# Altium schematic sheet power_3V3.SchDoc
size A4
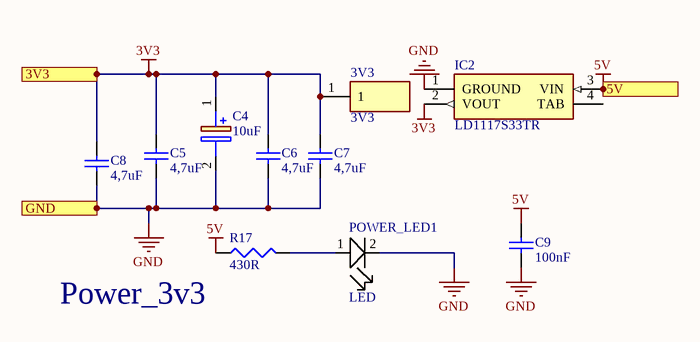
[diagram p0: power_3V3.SchDoc]

## Parts
3V3  3V3  [1508000150000030]
C4  10uF  [CAPPM3216X180N]
C5  4,7uF  [1608[0603]]
C6  4,7uF  [1608[0603]]
C7  4,7uF  [1608[0603]]
C8  4,7uF  [1608[0603]]
C9  100nF  [1608[0603]]
IC2  LD1117S33TR  [SOT230P700X180-4N]
POWER_LED1  LED  [LED5mA]
R17  430R  [J1-0603]

## Ports
3V3 (out), 5V (in), GND (in)

## Nets
3V3: 3V3.1 C4.1(+) C5.1 C6.1 C7.1 C8.1 IC2.2(VOUT) ; port 3V3
5V: C9.1 IC2.3(VIN) R17.1 ; port 5V
GND: C4.2(-) C5.2 C6.2 C7.2 C8.2 C9.2 IC2.1(GROUND) POWER_LED1.2 ; port GND
NetPOWER_LED1_1: POWER_LED1.1 R17.2

Not connected (* = marked no-connect by the designer): IC2 4(TAB)

## Notes on the sheet
- (near R17) Power_3v3

## Library data of the parts
3V3 = 5015: Undefined or Miscellaneous; Manufacturer_Name: Keystone Electronics; Allied_Number: 70182998; Datasheet Link: http://www.keyelco.com/product-pdf.cfm?p=1353; Height: 1.52mm; Manufacturer_Part_Number: 5015; Mouser Part Number: 534-5015; Mouser Price/Stock: https://www.mouser.com/Search/Refine.aspx?Keyword=534-5015; Allied Price/Stock: https://www.alliedelec.com/keystone-electronics-5015/70182998/
C4 = TAJA106K004RNJ: Capacitor Polarised; Manufacturer_Name: AVX; Datasheet Link: http://www.farnell.com/datasheets/1680476.pdf; Height: 1.8mm; Manufacturer_Part_Number: TAJA106K004RNJ; Mouser Part Number: 581-TAJA106K004R; Mouser Price/Stock: https://www.mouser.com/Search/Refine.aspx?Keyword=581-TAJA106K004R
C5-C9 = Cap Semi: Capacitor; Value: 100pF; Published: 8-Jun-2000; LatestRevisionDate: 29-May-2009; LatestRevisionNote: IPC-7351 Footprint Added.; PackageReference: C1206; Publisher: Altium Limited; PackageDescription: Chip Capacitor
IC2 = LD1117S33TR: Integrated Circuit; Manufacturer_Name: STMicroelectronics; Allied_Number: 70390201; Datasheet Link: http://www.st.com/st-web-ui/static/active/en/resource/technical/document/datasheet/CD00000544.pdf; Height: 1.8mm; Manufacturer_Part_Number: LD1117S33TR; Mouser Part Number: 511-LD1117S33; Mouser Price/Stock: https://www.mouser.com/Search/Refine.aspx?Keyword=511-LD1117S33; RS Part Number: 7140697P; RS Price/Stock: http://uk.rs-online.com/web/p/products/7140697P; Allied Price/Stock: http://www.alliedelec.com/stmicroelectronics-ld1117s33tr/70390201/
R17 = Res3: Resistor; Published: 8-Jun-2000; LatestRevisionDate: 29-May-2009; LatestRevisionNote: IPC-7351 Footprint Added.; PackageReference: J1-0603; Publisher: Altium Limited; PackageDescription: Chip Resistor; Value: 430R